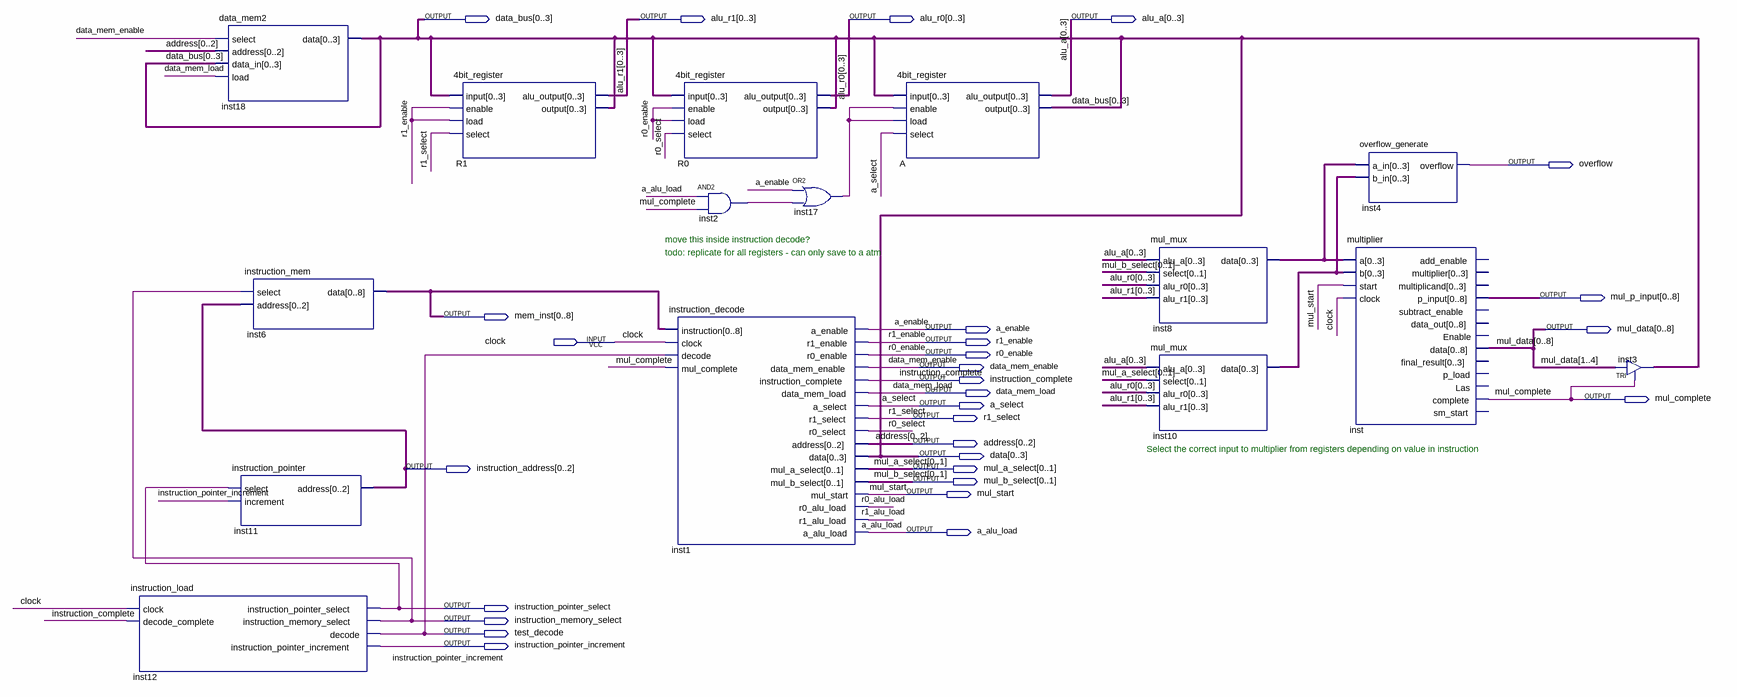
[diagram p0: schematic sheet]
// Quartus schematic top_level.bdf as structural Verilog: 15 symbols, 29 pins
module top_level (
  input  clock,
  output [0:3] data_bus,
  output [0:3] alu_r1,
  output [0:3] alu_r0,
  output [0:3] alu_a,
  output overflow,
  output [0:8] mul_p_input,
  output [0:8] mem_inst,
  output a_enable,
  output [0:8] mul_data,
  output r1_enable,
  output r0_enable,
  output data_mem_enable,
  output instruction_complete,
  output data_mem_load,
  output mul_complete,
  output a_select,
  output r1_select,
  output [0:2] address,
  output [0:3] data,
  output [0:2] instruction_address,
  output [0:1] mul_a_select,
  output [0:1] mul_b_select,
  output mul_start,
  output a_alu_load,
  output instruction_pointer_select,
  output instruction_memory_select,
  output test_decode,
  output instruction_pointer_increment
);

  wire inst2_out, inst17_out, r0_alu_load, r0_select, r1_alu_load;
  wire [3:0] inst8_data, inst10_data;

  instruction_load inst12 (
    .clock(clock), .decode_complete(instruction_complete),
    .instruction_pointer_select(instruction_pointer_select),
    .instruction_memory_select(instruction_memory_select), .decode(test_decode),
    .instruction_pointer_increment(instruction_pointer_increment));
  data_mem2 inst18 (.select(data_mem_enable), .address(address), .data_in(data), .load(data_mem_load), .data(data));
  instruction_pointer inst11 (
    .select(instruction_pointer_select), .increment(instruction_pointer_increment),
    .address(instruction_address));
  instruction_mem inst6 (.select(instruction_memory_select), .address(instruction_address), .data(mem_inst));
  \4bit_register  R1 (
    .\input (data), .enable(r1_enable), .load(r1_enable), .select(r1_select), .alu_output(alu_r1),
    .\output (data));
  \4bit_register  R0 (
    .\input (data), .enable(r0_enable), .load(r0_enable), .select(r0_select), .alu_output(alu_r0),
    .\output (data));
  instruction_decode inst1 (
    .instruction(mem_inst), .clock(clock), .decode(test_decode), .mul_complete(mul_complete),
    .a_enable(a_enable), .r1_enable(r1_enable), .r0_enable(r0_enable), .data_mem_enable(data_mem_enable),
    .instruction_complete(instruction_complete), .data_mem_load(data_mem_load), .a_select(a_select),
    .r1_select(r1_select), .r0_select(r0_select), .address(address), .data(data),
    .mul_a_select(mul_a_select), .mul_b_select(mul_b_select), .mul_start(mul_start),
    .r0_alu_load(r0_alu_load), .r1_alu_load(r1_alu_load), .a_alu_load(a_alu_load));
  and inst2 (inst2_out, a_alu_load, mul_complete);
  or inst17 (inst17_out, a_enable, inst2_out);
  \4bit_register  A (
    .\input (data), .enable(inst17_out), .load(inst17_out), .select(a_select), .alu_output(alu_a),
    .\output (data));
  mul_mux inst8 (.alu_a(alu_a), .select(mul_b_select), .alu_r0(alu_r0), .alu_r1(alu_r1), .data(inst8_data));
  mul_mux inst10 (.alu_a(alu_a), .select(mul_a_select), .alu_r0(alu_r0), .alu_r1(alu_r1), .data(inst10_data));
  multiplier inst (
    .a(inst8_data), .b(inst10_data), .start(mul_start), .clock(clock), .p_input(mul_p_input),
    .data(mul_data), .complete(mul_complete));  // open: add_enable, multiplier, multiplicand, subtract_enable, data_out, Enable, final_result, p_load, Las, sm_start
  overflow_generate inst4 (.a_in(inst8_data), .b_in(inst10_data), .overflow(overflow));
  TRI inst3[3:0] (.IN(mul_data[1:4]), .OE(mul_complete), .OUT(data));

  assign data_bus = data;

  // Notes on the sheet:
  //   move this inside instruction decode?
  //   todo: replicate for all registers - can only save to a atm
  //   Select the correct input to multiplier from registers depending on value in instruction
endmodule
